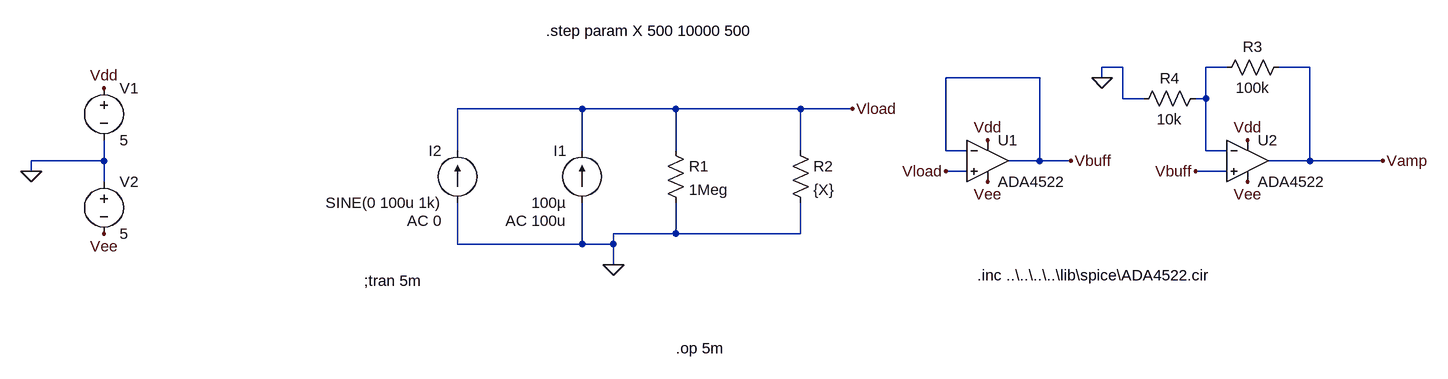
[diagram p0: schematic Parallel_Droop.asc]
Parallel_Droop.asc, the LTspice schematic file:
Version 4
SHEET 1 1396 680
WIRE 912 0 880 0
WIRE 1072 0 1040 0
WIRE 1200 0 1152 0
WIRE 784 16 640 16
WIRE 880 16 880 0
WIRE 912 48 912 0
WIRE 944 48 912 48
WIRE 1040 48 1040 0
WIRE 1040 48 1024 48
WIRE 80 64 -112 64
WIRE 224 64 80 64
WIRE 416 64 224 64
WIRE 496 64 416 64
WIRE -112 128 -112 64
WIRE 80 128 80 64
WIRE 224 128 224 64
WIRE 416 128 416 64
WIRE 640 128 640 16
WIRE 672 128 640 128
WIRE 1040 128 1040 48
WIRE 1072 128 1040 128
WIRE -656 144 -656 112
WIRE -656 144 -768 144
WIRE 784 144 784 16
WIRE 784 144 736 144
WIRE 832 144 784 144
WIRE 1200 144 1200 0
WIRE 1200 144 1136 144
WIRE 1312 144 1200 144
WIRE -768 160 -768 144
WIRE 672 160 640 160
WIRE 1072 160 1024 160
WIRE -656 176 -656 144
WIRE 224 256 224 208
WIRE 224 256 128 256
WIRE 416 256 416 208
WIRE 416 256 224 256
WIRE -112 272 -112 208
WIRE 80 272 80 208
WIRE 80 272 -112 272
WIRE 128 272 128 256
WIRE 128 272 80 272
WIRE 128 304 128 272
FLAG 128 304 0
FLAG -768 160 0
FLAG -656 32 Vdd
FLAG -656 256 Vee
FLAG 704 112 Vdd
FLAG 1104 112 Vdd
FLAG 704 176 Vee
FLAG 1104 176 Vee
FLAG 496 64 Vload
FLAG 640 160 Vload
FLAG 832 144 Vbuff
FLAG 1024 160 Vbuff
FLAG 880 16 0
FLAG 1312 144 Vamp
SYMBOL res 208 112 R0
SYMATTR InstName R1
SYMATTR Value 1Meg
SYMBOL res 400 112 R0
SYMATTR InstName R2
SYMATTR Value {X}
SYMBOL current 80 208 R180
WINDOW 0 24 80 Left 2
WINDOW 3 24 0 Left 2
WINDOW 123 24 -28 Left 2
WINDOW 39 0 0 Left 2
SYMATTR InstName I1
SYMATTR Value 100µ
SYMATTR Value2 AC 100u
SYMBOL voltage -656 16 R0
WINDOW 123 0 0 Left 2
WINDOW 39 0 0 Left 2
SYMATTR InstName V1
SYMATTR Value 5
SYMBOL voltage -656 160 R0
WINDOW 123 0 0 Left 2
WINDOW 39 0 0 Left 2
SYMATTR InstName V2
SYMATTR Value 5
SYMBOL Opamps\\opamp2 704 80 R0
SYMATTR InstName U1
SYMATTR Value ADA4522
SYMBOL Opamps\\opamp2 1104 80 R0
SYMATTR InstName U2
SYMATTR Value ADA4522
SYMBOL res 1168 -16 R90
WINDOW 0 0 56 VBottom 2
WINDOW 3 32 56 VTop 2
SYMATTR InstName R3
SYMATTR Value 100k
SYMBOL res 1040 32 R90
WINDOW 0 0 56 VBottom 2
WINDOW 3 32 56 VTop 2
SYMATTR InstName R4
SYMATTR Value 10k
SYMBOL current -112 208 R180
WINDOW 0 24 80 Left 2
WINDOW 3 24 0 Left 2
WINDOW 123 24 -28 Left 2
WINDOW 39 0 0 Left 2
SYMATTR InstName I2
SYMATTR Value SINE(0 100u 1k)
SYMATTR Value2 AC 0
TEXT 24 -56 Left 2 !.step param X 500 10000 500
TEXT 224 432 Left 2 !.op 5m
TEXT 688 320 Left 2 !.inc ..\\..\\..\\..\\lib\\spice\\ADA4522.cir
TEXT -256 328 Left 2 !;tran 5m

The netlist it stands for:
* Parallel_Droop.asc
R1 Vload 0 1Meg
R2 Vload 0 {X}
I1 0 Vload 100µ AC 100u
V1 Vdd 0 5
V2 0 Vee 5
XU1 Vload Vbuff Vdd Vee Vbuff ADA4522  ; pins In+ In- V+ V- OUT
XU2 Vbuff N001 Vdd Vee Vamp ADA4522  ; pins In+ In- V+ V- OUT
R3 Vamp N001 100k
R4 N001 0 10k
I2 0 Vload SINE(0 100u 1k) AC 0
.step param X 500 10000 500
.op 5m
.inc ..\..\..\..\lib\spice\ADA4522.cir
;tran 5m
.backanno
.end